# Altium project EA3059.PrjPcb
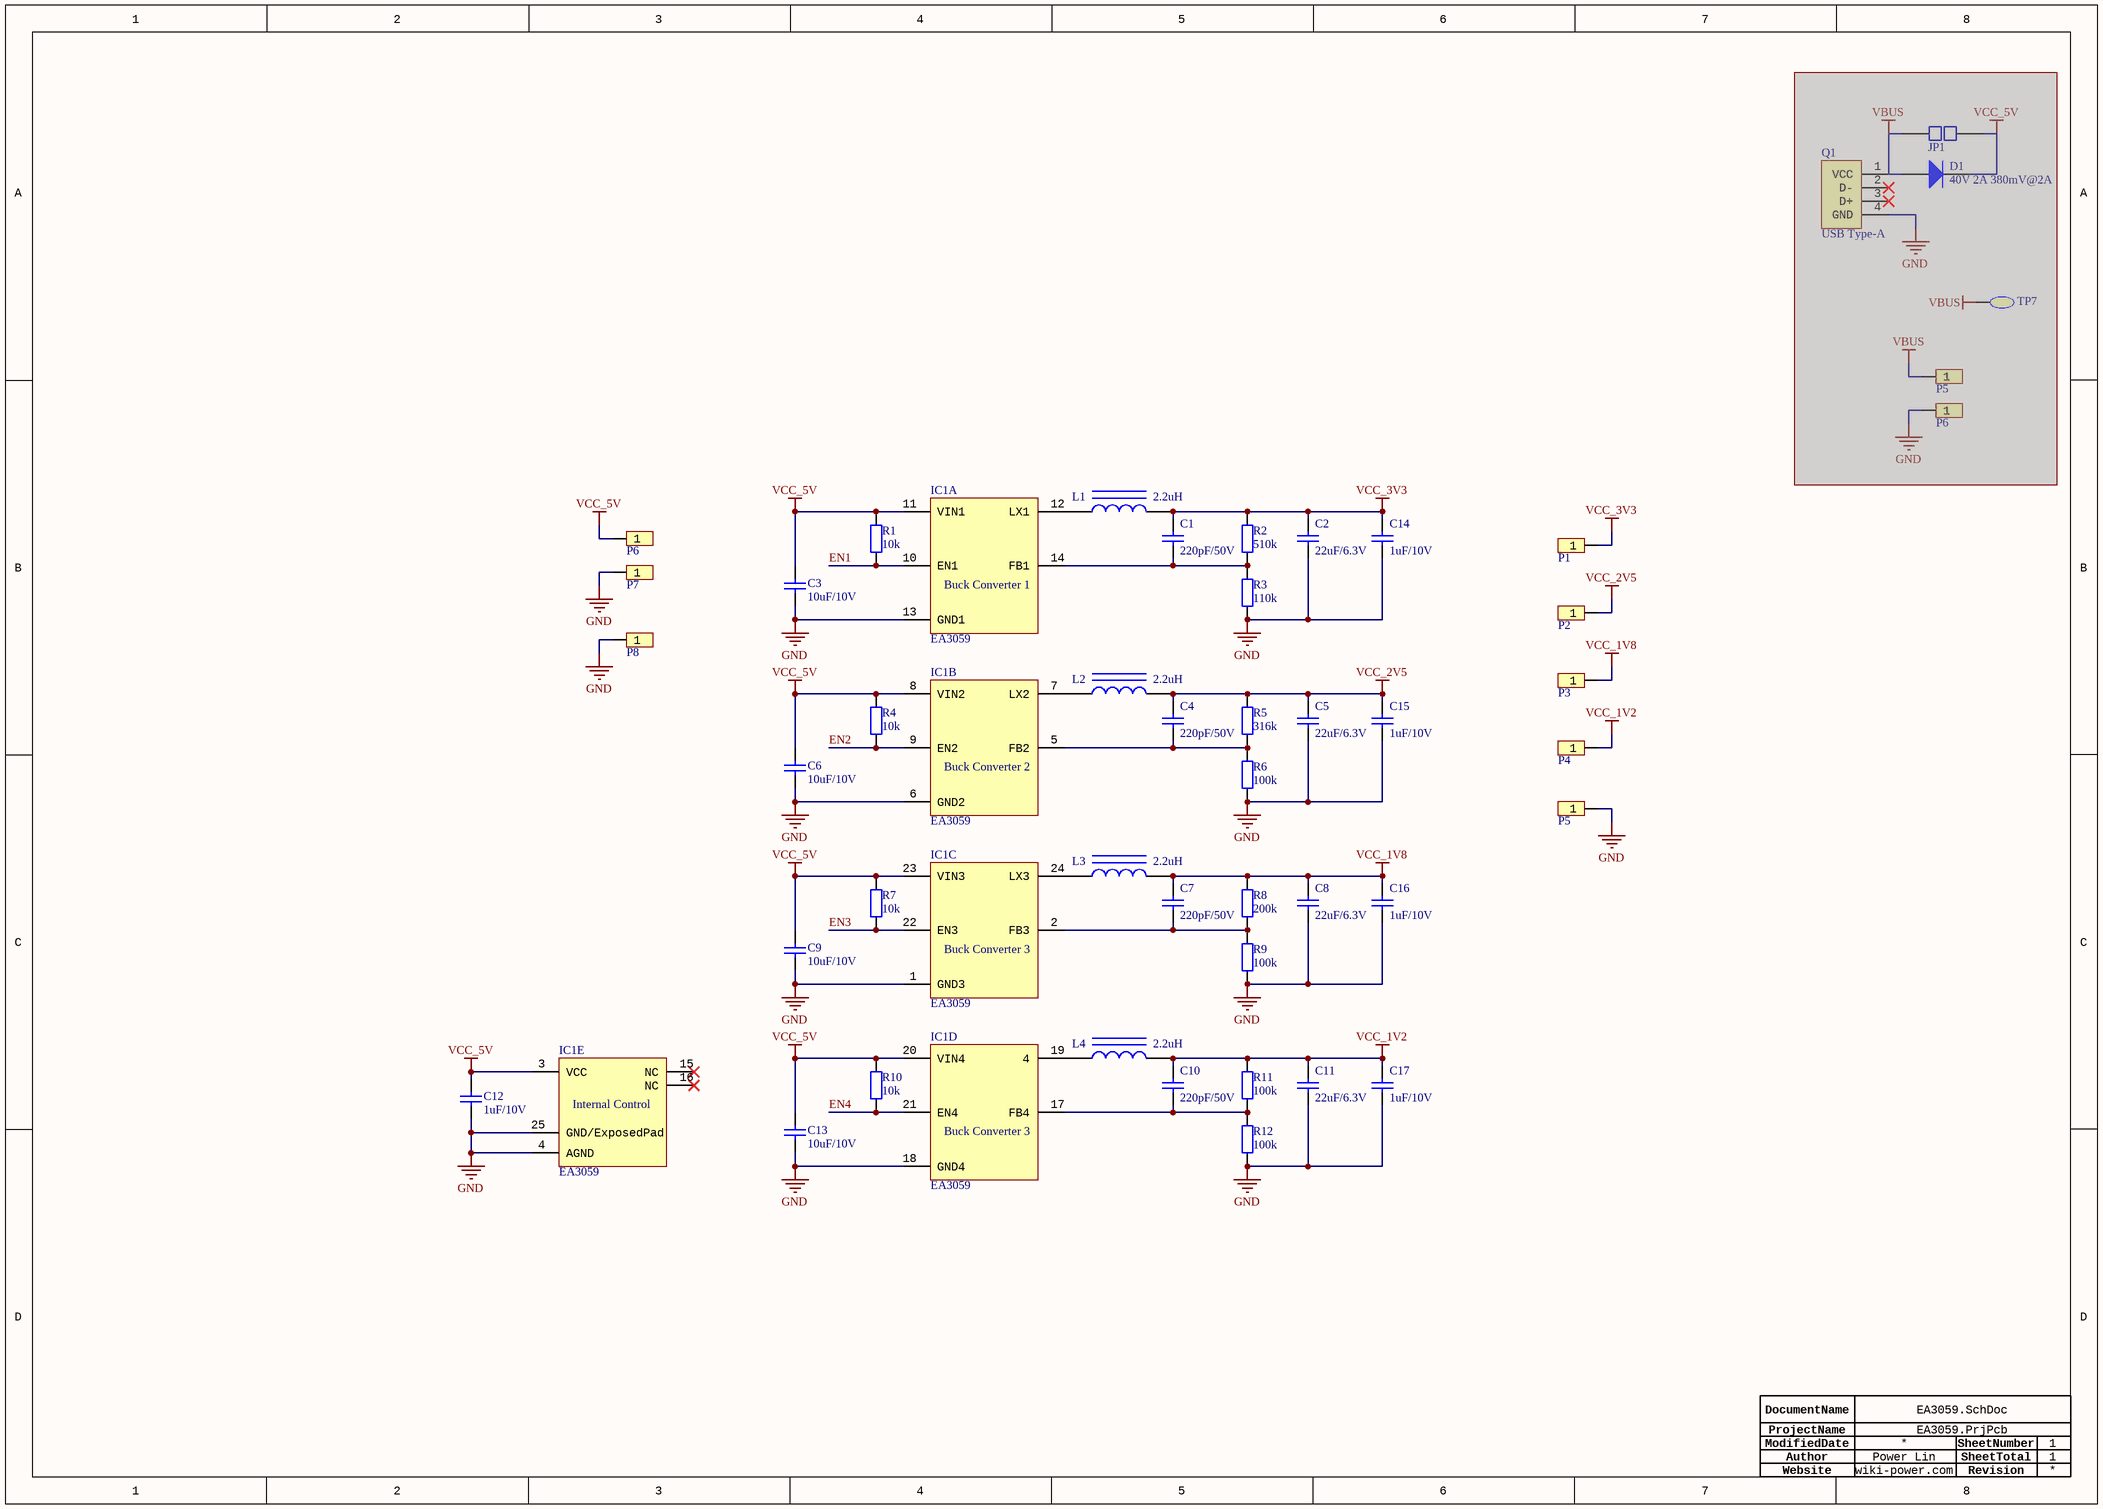
[diagram p0: EA3059.SchDoc]
1 sheet, 48 parts. Net scope: global (net labels, ports and power ports of the same name join across sheets).
Board file: EA3059.PcbDoc

## Sheet EA3059.SchDoc
size A3; Author: Power Lin; SheetNumber: 1; SheetTotal: 1; Website: wiki-power.com

### Parts
(Parts that share a designator on the sheet are numbered #1, #2 ... from top to bottom, then left to right.)
C1  220pF/50V  [CAP-0402]
C2  22uF/6.3V  [CAP-0402]
C3  10uF/10V  [CAP-0402]
C4  220pF/50V  [CAP-0402]
C5  22uF/6.3V  [CAP-0402]
C6  10uF/10V  [CAP-0402]
C7  220pF/50V  [CAP-0402]
C8  22uF/6.3V  [CAP-0402]
C9  10uF/10V  [CAP-0402]
C10  220pF/50V  [CAP-0402]
C11  22uF/6.3V  [CAP-0402]
C12  1uF/10V  [CAP-0402]
C13  10uF/10V  [CAP-0402]
C14  1uF/10V  [CAP-0402]
C15  1uF/10V  [CAP-0402]
C16  1uF/10V  [CAP-0402]
C17  1uF/10V  [CAP-0402]
D1  40V 2A 380mV@2A  [SOD_123]  (masked out: inside a compile mask, not in the netlist)
IC1  EA3059  [QFN-24-4x4]  (parts A,B,C,D,E of 5)
JP1  Select  [选择焊点-0402]  (value not drawn)  (masked out: inside a compile mask, not in the netlist)
L1  2.2uH  [L-1008]
L2  2.2uH  [L-1008]
L3  2.2uH  [L-1008]
L4  2.2uH  [L-1008]
P1  HDR1x2_2.54  [HDR1X1_2.54]  (value not drawn)
P2  HDR1x2_2.54  [HDR1X1_2.54]  (value not drawn)
P3  HDR1x2_2.54  [HDR1X1_2.54]  (value not drawn)
P4  HDR1x2_2.54  [HDR1X1_2.54]  (value not drawn)
P5#1  HDR1x2_2.54  [HDR1X1_2.54]  (value not drawn)  (masked out: inside a compile mask, not in the netlist)
P5#2  HDR1x2_2.54  [HDR1X1_2.54]  (value not drawn)
P6#1  HDR1x2_2.54  [HDR1X1_2.54]  (value not drawn)  (masked out: inside a compile mask, not in the netlist)
P6#2  HDR1x2_2.54  [HDR1X1_2.54]  (value not drawn)
P7  HDR1x2_2.54  [HDR1X1_2.54]  (value not drawn)
P8  HDR1x2_2.54  [HDR1X1_2.54]  (value not drawn)
Q1  USB Type-A  [USB-A-male]  (masked out: inside a compile mask, not in the netlist)
R1  10k  [R-0402]
R2  510k  [R-0402]
R3  110k  [R-0402]
R4  10k  [R-0402]
R5  316k  [R-0402]
R6  100k  [R-0402]
R7  10k  [R-0402]
R8  200k  [R-0402]
R9  100k  [R-0402]
R10  10k  [R-0402]
R11  100k  [R-0402]
R12  100k  [R-0402]
TP7  TestPoint  [TestPoint]  (value not drawn)  (masked out: inside a compile mask, not in the netlist)

### Nets
GND: C2.1 C3.1 C5.1 C6.1 C8.1 C9.1 C11.1 C12.1 C13.1 C14.1 C15.1 C16.1 C17.1 IC1.1(GND3) IC1.4(AGND) IC1.6(GND2) IC1.13(GND1) IC1.18(GND4) IC1.25(GND/ExposedPad) P5#2.1 P7.1 P8.1 R3.1 R6.1 R9.1 R12.1
VCC_1V2: C10.2 C11.2 C17.2 L4.2 P4.1 R11.2
VCC_1V8: C7.2 C8.2 C16.2 L3.2 P3.1 R8.2
VCC_2V5: C4.2 C5.2 C15.2 L2.2 P2.1 R5.2
VCC_3V3: C1.2 C2.2 C14.2 L1.2 P1.1 R2.2
VCC_5V: C3.2 C6.2 C9.2 C12.2 C13.2 IC1.3(VCC) IC1.8(VIN2) IC1.11(VIN1) IC1.20(VIN4) IC1.23(VIN3) P6#2.1 R1.2 R4.2 R7.2 R10.2
EN1: IC1.10(EN1) R1.1
EN2: IC1.9(EN2) R4.1
EN3: IC1.22(EN3) R7.1
EN4: IC1.21(EN4) R10.1
NetC1_1: C1.1 IC1.14(FB1) R2.1 R3.2
NetC4_1: C4.1 IC1.5(FB2) R5.1 R6.2
NetC7_1: C7.1 IC1.2(FB3) R8.1 R9.2
NetC10_1: C10.1 IC1.17(FB4) R11.1 R12.2
NetIC1_7: IC1.7(LX2) L2.1
NetIC1_12: IC1.12(LX1) L1.1
NetIC1_19: IC1.19(4) L4.1
NetIC1_24: IC1.24(LX3) L3.1

Not connected (* = marked no-connect by the designer): IC1 15(NC)* 16(NC)*

### Notes on the sheet
- Author
- DocumentName
- ModifiedDate
- ProjectName
- SheetNumber
- SheetTotal
- Website
- Revision
- (in symbol EA3059, part A) Buck Converter 1
- (in symbol EA3059, part B) Buck Converter 2
- (in symbol EA3059, part C) Buck Converter 3
- (in symbol EA3059, part D) Buck Converter 3
- (in symbol EA3059, part E) Internal Control

### Library data of the parts
C1 C4 C7 C10 = CAP: CC0402JRNPO9BN221(±5%); ComponentLink1Description: 供应商链接; ComponentLink1URL: http://www.szlcsc.com/product/details_53938.html; Package: 0402; Supplier: LC; SuppliersPartNumber: C52923
C2 C5 C8 C11 = CAP: GRM155R60J226ME11D(±20%); ComponentLink1Description: 供应商链接; ComponentLink1URL: http://www.szlcsc.com/product/details_53938.html; Package: 0402; Supplier: LC; SuppliersPartNumber: C52923
C3 C6 C9 C13 = CAP: CC0402MRX5R6BB106(±20%); ComponentLink1Description: 供应商链接; ComponentLink1URL: http://www.szlcsc.com/product/details_53938.html; Package: 0402; Supplier: LC; SuppliersPartNumber: C52923
C12 C14-C17 = CAP: CC0402KRX5R6BB105(±10%); ComponentLink1Description: 供应商链接; ComponentLink1URL: http://www.szlcsc.com/product/details_53938.html; Package: 0402; Supplier: LC; SuppliersPartNumber: C52923
D1 = DIODE: PSBD1DF40V2L; ComponentLink1Description: 供应商链接; ComponentLink1URL: http://www.szlcsc.com/product/details_23178.html; Package: SMA(DO-214AC); Supplier: LC; SuppliersPartNumber: C22452
IC1 = EA3059: 4CH PMIC
JP1 = Select: 选择焊点
L1-L4 = INDUCTOR: SRN2512-2R2M; ComponentLink1Description: 供应商链接; ComponentLink1URL: http://www.szlcsc.com/product/details_33003.html; Package: 0402; Supplier: LC; SuppliersPartNumber: C32041
P1-P4 P5#1 P5#2 P6#1 P6#2 P7 P8 = HDR1x1_2.54: Header
Q1 = USB A: U217-041N-4BV81
R1 R4 R7 R10 = RES: RC0402FR-0710KL; Package: 0805; Supplier: LC; SuppliersPartNumber: C17798
R2 = RES: RC0402FR-07510KL; Package: 0805; Supplier: LC; SuppliersPartNumber: C17798
R3 = RES: AC0402FR-07110KL; Package: 0805; Supplier: LC; SuppliersPartNumber: C17798
R5 = RES: RC0402FR-07316KL; Package: 0805; Supplier: LC; SuppliersPartNumber: C17798
R6 R9 R11 R12 = RES: RC0402FR-07100KL; Package: 0805; Supplier: LC; SuppliersPartNumber: C17798
R8 = RES: RC0402FR-07200KL; Package: 0805; Supplier: LC; SuppliersPartNumber: C17798
TP7 = TestPoint: 测试点